# EAGLE design MODULO2_2 (EAGLE 7.1.0)
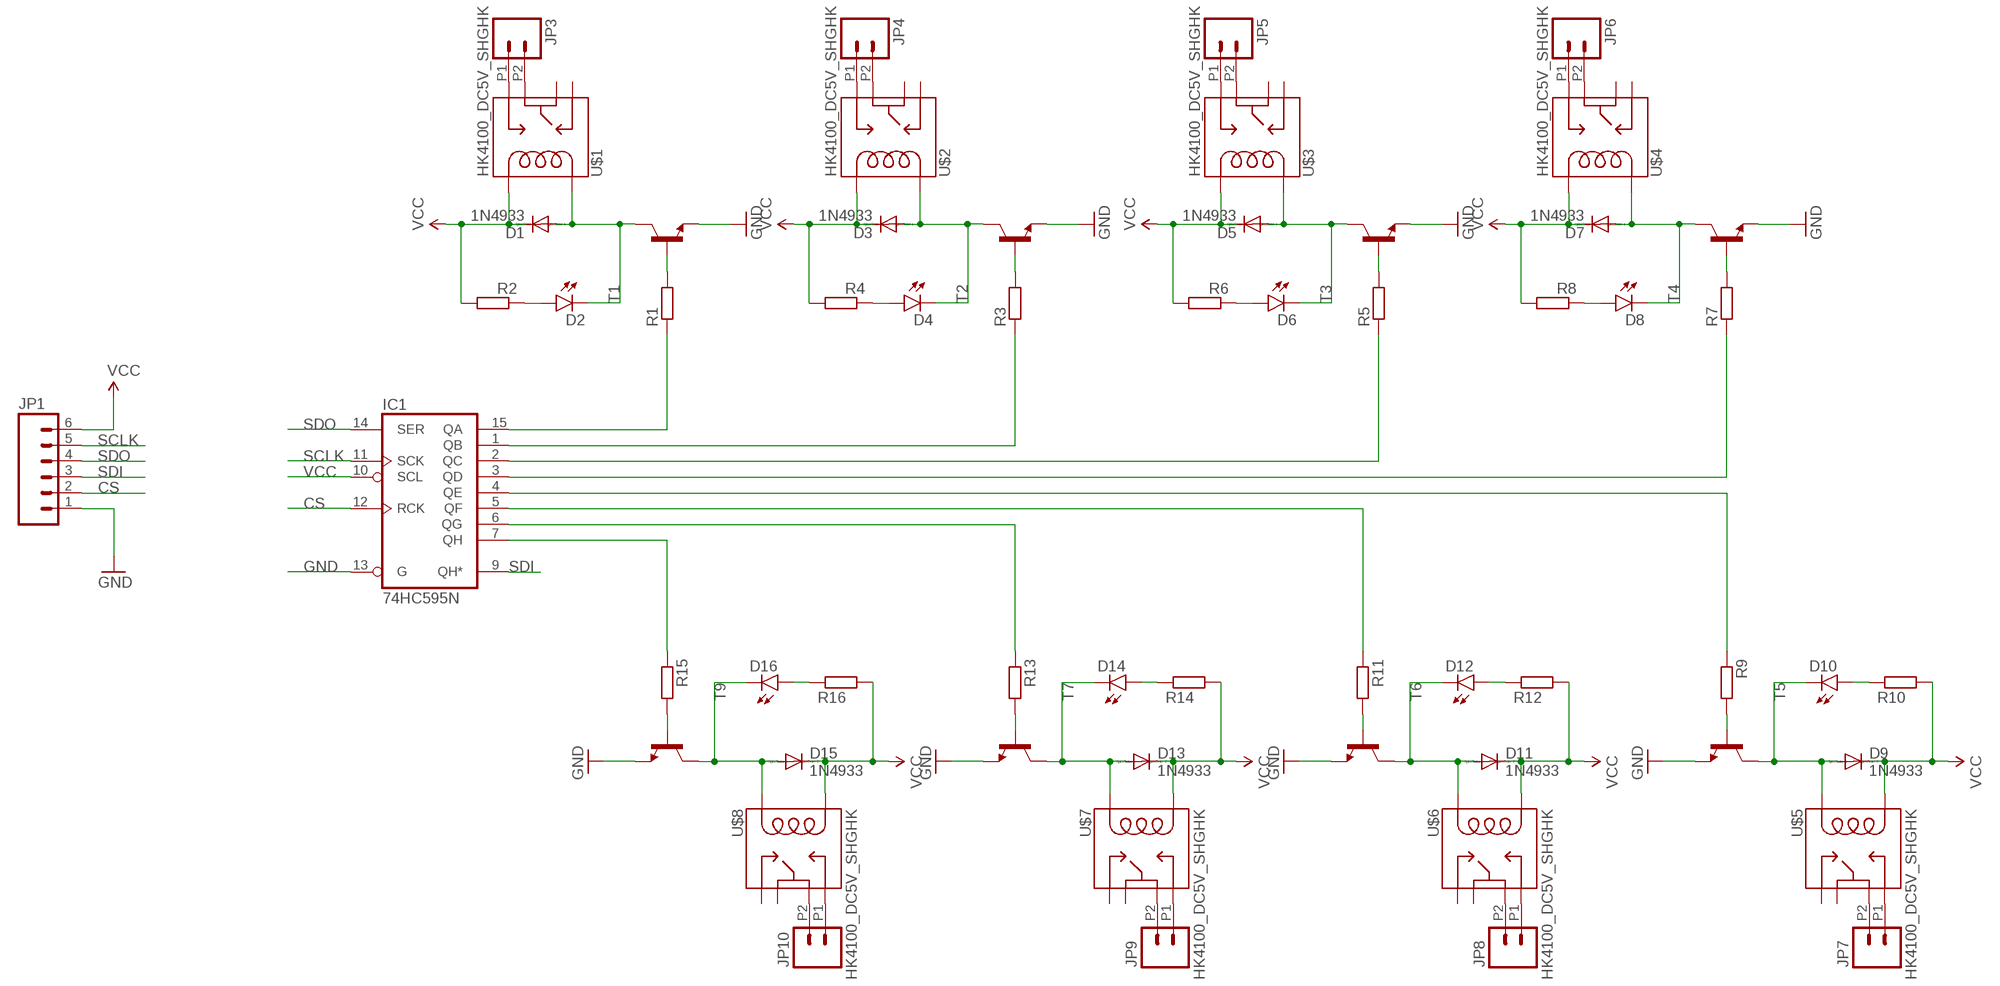
[diagram p0: schematic, sheet 1]

## Parts
D1  1N4933  [DO41-10]
D2  LED5MM  [LED5MM]
D3  1N4933  [DO41-10]
D4  LED5MM  [LED5MM]
D5  1N4933  [DO41-10]
D6  LED5MM  [LED5MM]
D7  1N4933  [DO41-10]
D8  LED5MM  [LED5MM]
D9  1N4933  [DO41-10]
D10  LED5MM  [LED5MM]
D11  1N4933  [DO41-10]
D12  LED5MM  [LED5MM]
D13  1N4933  [DO41-10]
D14  LED5MM  [LED5MM]
D15  1N4933  [DO41-10]
D16  LED5MM  [LED5MM]
IC1  74HC595N  [DIL16]
JP1  M06LOCK  [1X06_LOCK]
JP3  M022.54MM_SCREWTERM  [1X02_2.54_SCREWTERM]
JP4  M022.54MM_SCREWTERM  [1X02_2.54_SCREWTERM]
JP5  M022.54MM_SCREWTERM  [1X02_2.54_SCREWTERM]
JP6  M022.54MM_SCREWTERM  [1X02_2.54_SCREWTERM]
JP7  M022.54MM_SCREWTERM  [1X02_2.54_SCREWTERM]
JP8  M022.54MM_SCREWTERM  [1X02_2.54_SCREWTERM]
JP9  M022.54MM_SCREWTERM  [1X02_2.54_SCREWTERM]
JP10  M022.54MM_SCREWTERM  [1X02_2.54_SCREWTERM]
R1  R-EU_R0805  [R0805]
R2  R-EU_R0805  [R0805]
R3  R-EU_R0805  [R0805]
R4  R-EU_R0805  [R0805]
R5  R-EU_R0805  [R0805]
R6  R-EU_R0805  [R0805]
R7  R-EU_R0805  [R0805]
R8  R-EU_R0805  [R0805]
R9  R-EU_R0805  [R0805]
R10  R-EU_R0805  [R0805]
R11  R-EU_R0805  [R0805]
R12  R-EU_R0805  [R0805]
R13  R-EU_R0805  [R0805]
R14  R-EU_R0805  [R0805]
R15  R-EU_R0805  [R0805]
R16  R-EU_R0805  [R0805]
T1  -NPN-TO92-EBC  [TO92-EBC]
T2  -NPN-TO92-EBC  [TO92-EBC]
T3  -NPN-TO92-EBC  [TO92-EBC]
T4  -NPN-TO92-EBC  [TO92-EBC]
T5  -NPN-TO92-EBC  [TO92-EBC]
T6  -NPN-TO92-EBC  [TO92-EBC]
T7  -NPN-TO92-EBC  [TO92-EBC]
T9  -NPN-TO92-EBC  [TO92-EBC]
U$1  HK4100_DC5V_SHGHK  [HK4100]
U$2  HK4100_DC5V_SHGHK  [HK4100]
U$3  HK4100_DC5V_SHGHK  [HK4100]
U$4  HK4100_DC5V_SHGHK  [HK4100]
U$5  HK4100_DC5V_SHGHK  [HK4100]
U$6  HK4100_DC5V_SHGHK  [HK4100]
U$7  HK4100_DC5V_SHGHK  [HK4100]
U$8  HK4100_DC5V_SHGHK  [HK4100]

## Nets
CS: IC1.12(RCK) JP1.2
GND: IC1.13(G) JP1.1 T1.E T2.E T3.E T4.E T5.E T6.E T7.E T9.E
N$1: IC1.15(QA) R1.1
N$2: IC1.1(QB) R3.1
N$3: D1.A D2.K(C) T1.C U$1.6
N$4: D2.A R2.1
N$5: R1.2 T1.B
N$6: D3.A D4.K(C) T2.C U$2.6
N$7: D5.A D6.K(C) T3.C U$3.6
N$8: D6.A R6.1
N$9: R5.2 T3.B
N$10: D7.A D8.K(C) T4.C U$4.6
N$11: D8.A R8.1
N$12: R7.2 T4.B
N$13: IC1.3(QD) R7.1
N$14: D4.A R4.1
N$15: R3.2 T2.B
N$16: IC1.2(QC) R5.1
N$17: D9.A D10.K(C) T5.C U$5.6
N$18: D10.A R10.1
N$19: R9.2 T5.B
N$20: D11.A D12.K(C) T6.C U$6.6
N$21: D12.A R12.1
N$22: R11.2 T6.B
N$23: D13.A D14.K(C) T7.C U$7.6
N$24: D14.A R14.1
N$25: R13.2 T7.B
N$26: D15.A D16.K(C) T9.C U$8.6
N$27: D16.A R16.1
N$28: R15.2 T9.B
N$29: IC1.5(QF) R11.1
N$30: IC1.4(QE) R9.1
N$31: IC1.6(QG) R13.1
N$32: IC1.7(QH) R15.1
N$34: JP3.P1 U$1.8
N$35: JP3.P2 U$1.14
N$36: JP4.P1 U$2.8
N$37: JP4.P2 U$2.14
N$38: JP5.P1 U$3.8
N$39: JP5.P2 U$3.14
N$40: JP6.P1 U$4.8
N$41: JP6.P2 U$4.14
N$42: JP7.P1 U$5.8
N$43: JP7.P2 U$5.14
N$44: JP8.P1 U$6.8
N$45: JP8.P2 U$6.14
N$46: JP9.P1 U$7.8
N$47: JP9.P2 U$7.14
N$48: JP10.P1 U$8.8
N$49: JP10.P2 U$8.14
SCLK: IC1.11(SCK) JP1.5
SDI: IC1.9(QH*) JP1.3
SDO: IC1.14(SER) JP1.4
VCC: D1.C D3.C D5.C D7.C D9.C D11.C D13.C D15.C IC1.10(SCL) JP1.6 R2.2 R4.2 R6.2 R8.2 R10.2 R12.2 R14.2 R16.2 U$1.9 U$2.9 U$3.9 U$4.9 U$5.9 U$6.9 U$7.9 U$8.9
Unconnected: U$1.1 U$1.7 U$2.1 U$2.7 U$3.1 U$3.7 U$4.1 U$4.7 U$5.1 U$5.7 U$6.1 U$6.7 U$7.1 U$7.7 U$8.1 U$8.7

## Power pins joined to a net without a drawn wire
GND: IC1.8(GND)
VCC: IC1.16(VCC)

## Library data of the parts
D1 D3 D5 D7 D9 D11 D13 D15 = diode:1N4933: DIODE fast recovery rectifier, 1A
D2 D4 D6 D8 D10 D12 D14 D16 = SparkFun-LED:LED: LEDs Standard schematic elements and footprints for 5mm, 3mm, 1206, and 0603 sized LEDs. 5mm - Spark Fun Electronics SKU : COM-00529 (and others)
IC1 = 74xx-eu:74*595: 8-bit SHIFT REGISTER, output latch
JP1 = SparkFun-Connectors:M06: Header 6 Standard 6-pin 0.1" header. Use with straight break away headers (SKU : PRT-00116), right angle break away headers (PRT-00553), swiss pins (PRT-00743), machine pins (PRT-00117), and female headers (PRT-00115). Molex polarized connector foot print use with SKU : PRT-08094 with associated crimp pins and housings. NOTES ON THE VARIANTS LOCK and LOCK_LONGPADS... This footprint was designed to help hold the alignment of a through-hole component (i.e. 6-pin header) while soldering it into place. You may notice that each hole has been shifted either up or down by 0.005 of an inch from it's more standard position (which is a perfectly straight line). This slight alteration caused the pins (the squares in the middle) to touch the edges of the holes. Because they are alternating, it causes a "brace" to hold the component in place. 0.005 has proven to be the perfect amount of "off-center" position when using our standard breakaway headers. Although looks a little odd when you look at the bare footprint, once you have a header in there, the alteration is very hard to notice. Also,if you push a header all the way into place, it is covered up entirely on the bottom side. This idea of altering the position of holes to aid alignment will be further integrated into the Sparkfun Library for other footprints. It can help hold any component with 3 or more connection pins.
JP3-JP10 = SparkFun-Connectors:M02: Standard 2-pin 0.1" header. Use with - straight break away headers ( PRT-00116) - right angle break away headers (PRT-00553) - swiss pins (PRT-00743) - machine pins (PRT-00117) - female headers (PRT-00115) Molex polarized connector foot print use with: PRT-08233 with associated crimp pins and housings. 2.54_SCREWTERM for use with PRT-10571. 3.5mm Screw Terminal footprints for PRT-08084 5mm Screw Terminal footprints for use with PRT-08432
R1-R16 = resistor:R-EU_: RESISTOR, European symbol
T1-T7 T9 = transistor:*-NPN-: NPN Transistror BF959 corrected 2008.03.06
U$1-U$8 = SparkFun-Electromechanical:HK4100_DC5V_SHG

## Board
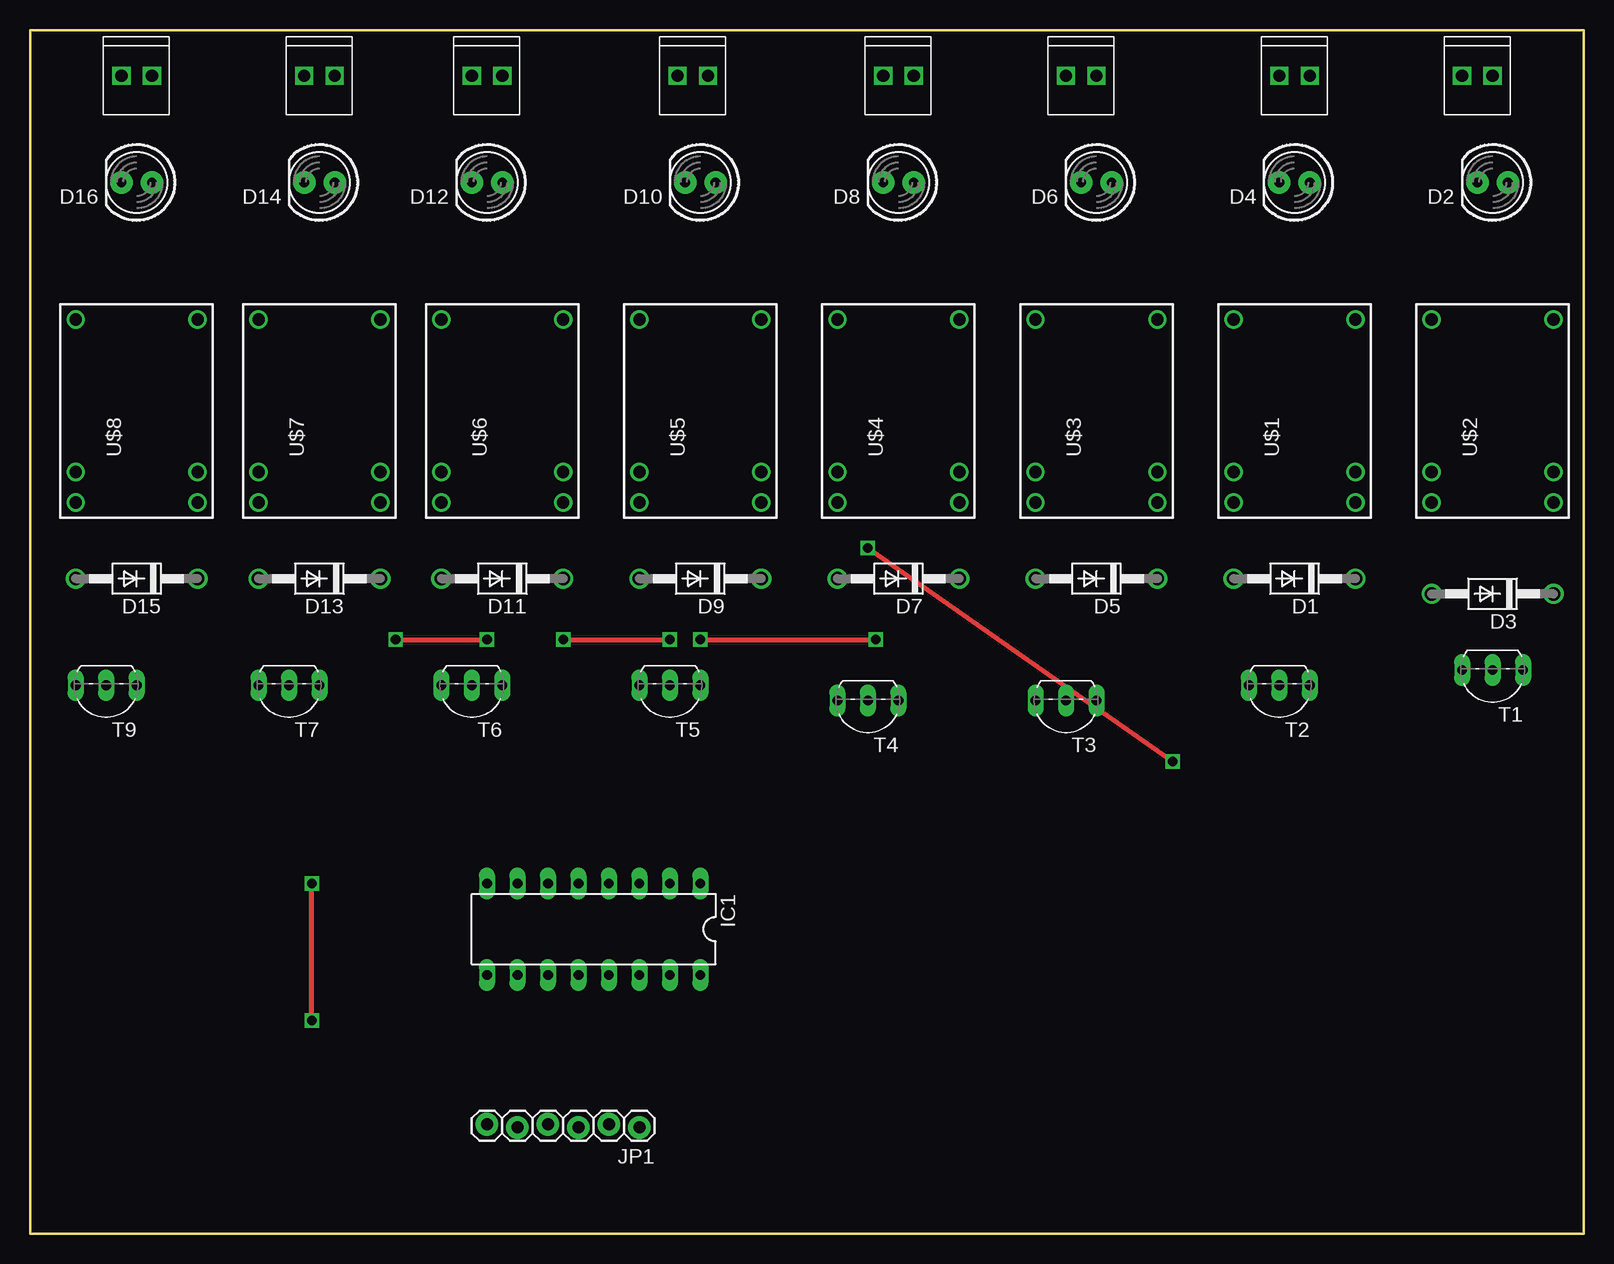
[diagram p1: board, top side]
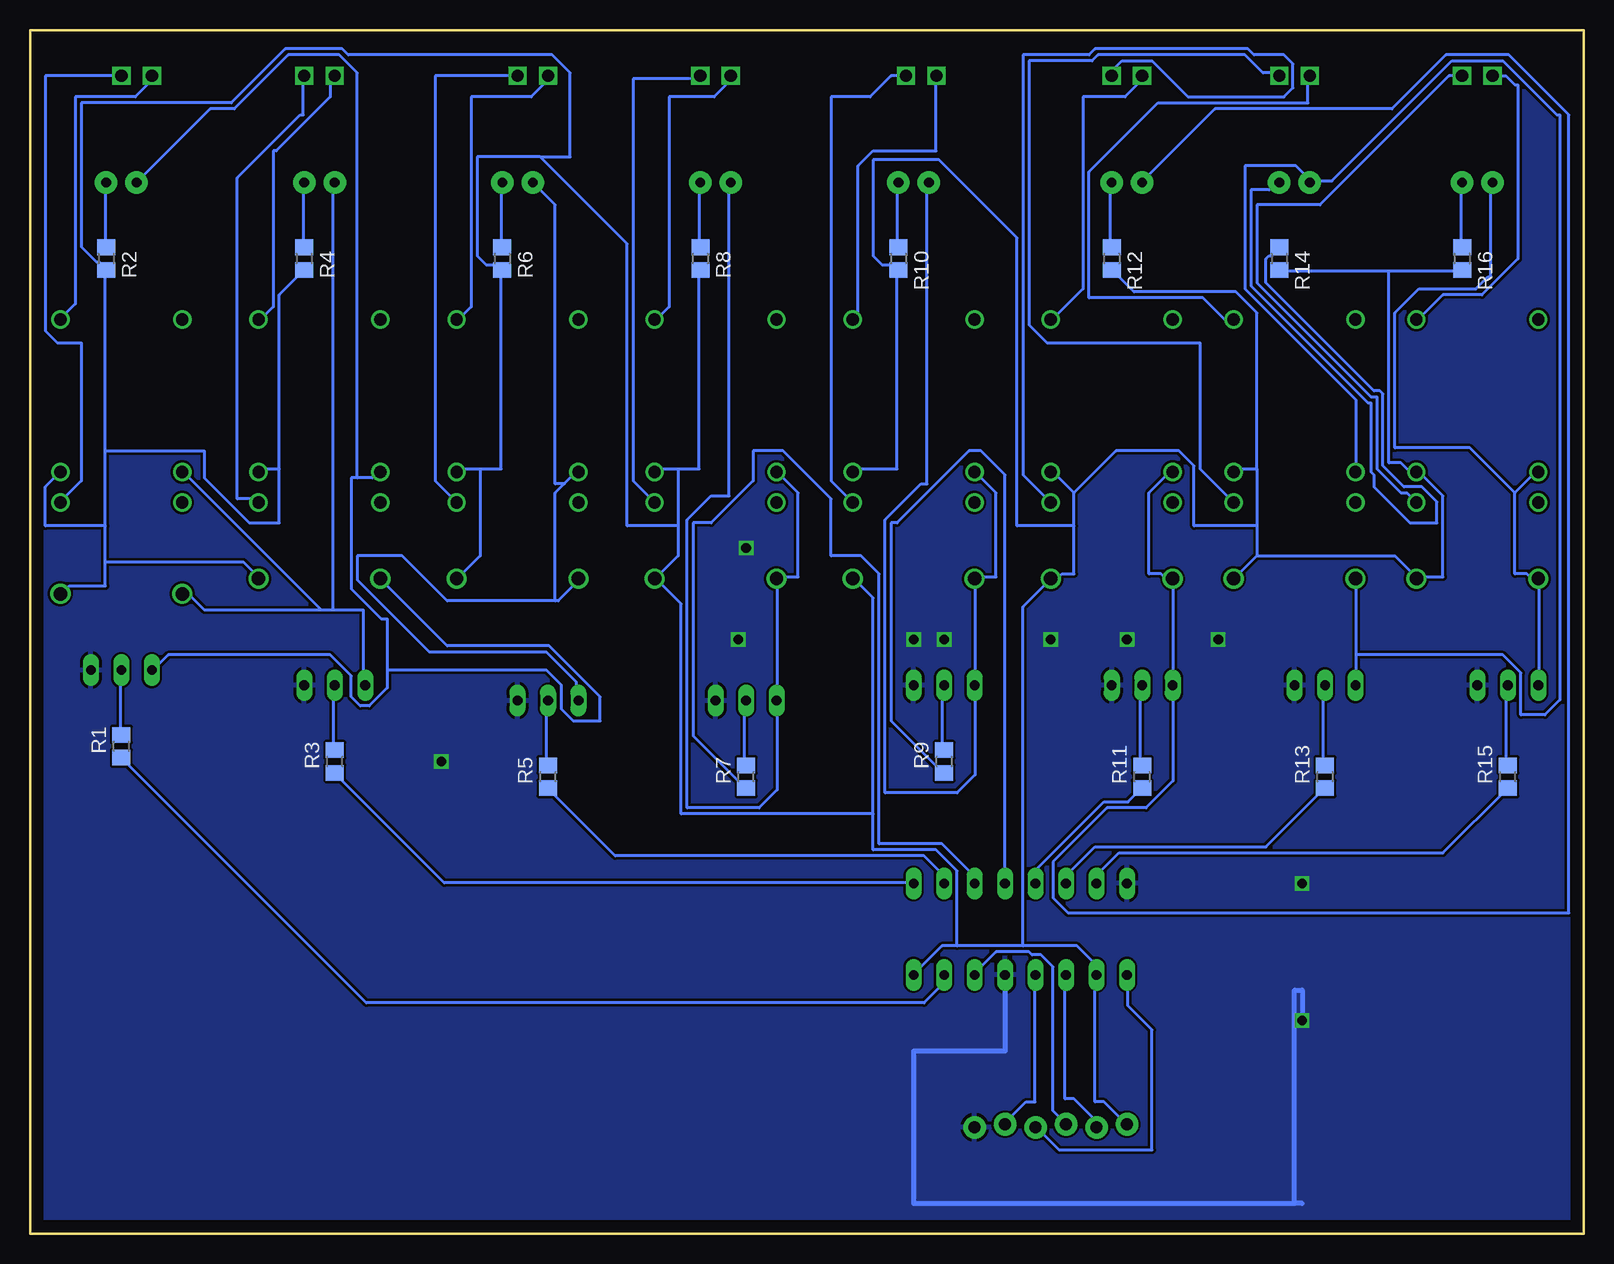
[diagram p2: board, bottom side, seen from below]

Size 129.54 x 100.33 mm. Coordinates in mm from the lower left corner, seen from the top.
Outline: 0,0 129.54,0 129.54,100.33 0,100.33 0,0
Copper layers (1*16): Top 0.035mm / dielectric 1.5mm / Bottom 0.035mm
Design rules "default": minimum track width 10mil, minimum drill 24mil, track to track 8mil, track to pad 8mil, pad to pad 8mil, via to via 8mil, smd to smd 8mil, copper to edge 40mil, drill to drill 8mil, minimum pad ring 10mil, minimum via ring 8mil, stop-mask expansion 4mil, vias tented up to drill 0mil, thermal gap 10mil

### Footprints (pad centres in the part's own frame; a part is rotated, then mirrored left to right if it is on the bottom)
DO41-10 = drill 1.118: A 5.08,0; C -5.08,0
LED5MM = drill 0.813 pad 1.88: A -1.27,0; K 1.27,0
DIL16 = drill 0.813 long: 1 -8.89,-3.81; 2 -6.35,-3.81; 3 -3.81,-3.81; 4 -1.27,-3.81; 5 1.27,-3.81; 6 3.81,-3.81; 7 6.35,-3.81; 8 8.89,-3.81; 9 8.89,3.81; 10 6.35,3.81; 11 3.81,3.81; 12 1.27,3.81; 13 -1.27,3.81; 14 -3.81,3.81; 15 -6.35,3.81; 16 -8.89,3.81
1X06_LOCK = drill 1.016 pad 1.88: 1 0,0; 2 2.54,-0.254; 3 5.08,0; 4 7.62,-0.254; 5 10.16,0; 6 12.7,-0.254
1X02_2.54_SCREWTERM = drill 1.016 square: P1 2.54,0; P2 0,0
R0805 = smd 1.3 x 1.5: 1 -0.95,0; 2 0.95,0
TO92-EBC = drill 0.813 long: B 0,-1.27; C 2.54,-1.27; E -2.54,-1.27
HK4100 = drill 1.016: 1 7.62,5.08; 6 -5.08,5.08; 7 -7.62,5.08; 8 -7.62,-5.08; 9 -5.08,-5.08; 14 7.62,-5.08

### Placement (x,y rotation side)
D1  105.41,54.61 180 top
D2  121.92,87.63 180 top
D3  121.92,53.34 180 top
D4  105.41,87.63 180 top
D5  88.9,54.61 180 top
D6  88.9,87.63 180 top
D7  72.39,54.61 180 top
D8  72.39,87.63 180 top
D9  55.88,54.61 180 top
D10  55.88,87.63 180 top
D11  39.37,54.61 180 top
D12  38.1,87.63 180 top
D13  24.13,54.61 180 top
D14  24.13,87.63 180 top
D15  8.89,54.61 180 top
D16  8.89,87.63 180 top
IC1  46.99,25.4 180 top
JP1  50.8,8.89 180 top
JP3  104.14,96.52 0 top
JP4  119.38,96.52 0 top
JP5  86.36,96.52 0 top
JP6  71.12,96.52 0 top
JP7  53.98,96.52 0 top
JP8  36.83,96.52 0 top
JP9  22.86,96.52 0 top
JP10  7.62,96.52 0 top
R1  121.92,40.64 90 bottom
R2  123.19,81.28 270 bottom
R3  104.14,39.37 90 bottom
R4  106.68,81.28 270 bottom
R5  86.36,38.1 90 bottom
R6  90.17,81.28 270 bottom
R7  69.85,38.1 90 bottom
R8  73.66,81.28 270 bottom
R9  53.34,39.37 90 bottom
R10  57.15,81.28 270 bottom
R11  36.83,38.1 90 bottom
R12  39.37,81.28 270 bottom
R13  21.59,38.1 90 bottom
R14  25.4,81.28 270 bottom
R15  6.35,38.1 90 bottom
R16  10.16,81.28 270 bottom
T1  121.92,45.72 180 top
T2  104.14,44.45 180 top
T3  86.36,43.18 180 top
T4  69.85,43.18 180 top
T5  53.34,44.45 180 top
T6  36.83,44.45 180 top
T7  21.59,44.45 180 top
T9  6.35,44.45 180 top
U$1  105.41,68.58 90 top
U$2  121.92,68.58 90 top
U$3  88.9,68.58 90 top
U$4  72.39,68.58 90 top
U$5  55.88,68.58 90 top
U$6  39.37,68.58 90 top
U$7  24.13,68.58 90 top
U$8  8.89,68.58 90 top

### Tracks (layer width: path | path; a pad name or v marks a point on that pad's centre or on a via)
CS
  Bottom 0.254: IC1.12 45.75,21.5 45.75,11 46.5,11 48.25,9.25 JP1.2
GND  (via drill 0.8)
  Top 0.406: v23.5,17.78 v23.5,29.21 | v30.48,49.53 v38.1,49.53 | v44.45,49.53 v53.34,49.53 | v55.88,49.53 v70.48,49.53 | v95.25,39.37 v69.85,57.15
  Bottom 0.406: IC1.13 48.26,15.24 55.88,15.24 55.88,2.54 24.13,2.54 | 23.5,2.54 24.13,2.54 | 24.13,2.54 24.13,20.32 23.5,20.32 v23.5,17.78
  pour Bottom: 0,0 0,100.33 129.54,100.33 129.54,0
N$1
  Bottom 0.254: R1.1 121.75,39.5 101.5,19.25 55,19.25 53.5,20.75 53.5,21.5 IC1.15
N$2
  Bottom 0.254: R3.1 104,38.25 95,29.25 56,29.25 IC1.1
N$3
  Bottom 0.254: 99.75,47 99.75,51.25 100.25,51.25 102.75,53.75 102.75,63 102.25,63 | 99.75,47 99.75,45.5 101.25,44 102,44 102.75,44.75 102.75,46.5 104.5,48.25 118,48.25 119.25,47 T1.C | 102.25,63 101,63 100.5,63.5 U$1.6 | 99.75,47 86.5,47 85.25,45.75 85.25,43.75 84.25,42.75 82,42.75 82,44.75 86.25,49 94.75,49 100.25,54.5 D1.A | 102.25,63 102.25,96.75 103.75,98.25 108,98.25 112.5,93.75 114.5,93.75 120.5,87.75 D2.K
N$4
  Bottom 0.254: R2.1 123.25,82.25 123.25,87.5 D2.A
N$5
  Bottom 0.254: R1.2 122,41.75 122,46.75 T1.B
N$6
  Bottom 0.254: 105.25,52 115,52 116.25,53.25 116.75,53.25 D3.A | 105.25,52 104.25,52 | 104.25,52 101.75,52 101.75,45.75 T2.C | 105.25,52 116.75,63.5 U$2.6 | 104.25,52 104.25,87.5 D4.K
N$7
  Bottom 0.254: 85.75,52.75 85.5,52.75 83.75,54.5 D5.A | 85.75,52.75 94.75,52.75 98.5,56.5 102.25,56.5 102.25,54.5 96.25,48.5 86.5,48.5 84,46 84,44.5 T3.C | 85,62.5 85.75,61.75 85.75,52.75 | 85,62.5 84,63.5 U$3.6 | D6.K 85.75,85.75 85.75,62.5 85,62.5
N$8
  Bottom 0.254: R6.1 90.25,82.25 90.25,87.5 D6.A
N$9
  Bottom 0.254: R5.2 86.5,39.25 86.5,44.25 T3.B
N$10
  Bottom 0.254: U$4.6 67.25,63.5 65.5,61.75 65.5,54.75 67.25,54.75 D7.A 67.25,54.5 67.25,44.5 T4.C 67.25,44.25 67.25,37 68.75,35.5 74.75,35.5 74.75,59.5 72.75,61.5 71.25,61.5 71.25,87.5 D8.K
N$11
  Bottom 0.254: R8.1 73.75,82.25 73.75,87.5 D8.A
N$12
  Bottom 0.254: R7.2 70,39.25 70,44.25 T4.B
N$13
  Bottom 0.254: R7.1 70,37.25 74.25,41.5 74.25,59.25 72.75,59.25 69.25,62.75 69.25,65.25 66.75,65.25 62.75,61.25 62.75,56.5 60.25,56.5 58.75,55 58.75,32.5 53.5,32.5 51,30 51,29.25 IC1.3
N$14
  Bottom 0.254: R4.1 106.75,82.25 106.75,87.5 D4.A
N$15
  Bottom 0.254: R3.2 104.25,40.5 104.25,45.5 T2.B
N$16
  Bottom 0.254: R5.1 86.25,37 80.75,31.5 55,31.5 53.5,30 53.5,29.25 IC1.2
N$17
  Bottom 0.254: U$5.6 50.75,63.5 49,61.75 49,54.75 50.75,54.75 D9.A 50.75,54.5 50.75,45.75 T5.C 50.75,45.5 50.75,38.25 52.25,36.75 58.25,36.75 58.25,59.5 55.25,62.5 54.75,62.5 54.75,87.5 D10.K
N$18
  Bottom 0.254: R10.1 57.25,82.25 57.25,87.5 D10.A
N$19
  Bottom 0.254: R9.2 53.5,40.5 53.5,45.5 T5.B
N$20
  Bottom 0.254: U$6.6 34.5,63.5 36.25,61.75 36.25,55 35.25,55 35,54.75 34.5,54.75 D11.A 34.25,54.5 34.25,45.75 T6.C 34.25,45.5 34.25,37.75 36.5,35.5 39.75,35.5 44.25,31 44.25,28 43,26.75 1.25,26.75 1.25,93.25 6.25,98.25 11.5,98.25 16,93.75 30.75,93.75 36.75,87.75 D12.K
N$21
  Bottom 0.254: R12.1 39.5,82.25 39.5,87.5 D12.A
N$22
  Bottom 0.254: R11.2 37,39.25 37,45.5 T6.B
N$23
  Bottom 0.254: 19,48.25 19,54.5 D13.A | 19,48.25 19,45.75 T7.C | 22.75,87.75 24,89 28.25,89 28.25,78.75 19,69.5 19,63.5 U$7.6 | 19,48.25 6.75,48.25 5.25,46.75 5.25,43.25 3.25,43.25 2,44.5 2,93.25 2.25,93.25 6.75,97.75 11,97.75 21,87.75 22.75,87.75 | 22.75,87.75 D14.K
N$24
  Bottom 0.254: R14.1 25.5,82 26,81.5 26.25,81.5 26.5,81.25 26.5,79.25 17.5,70.25 17,70.25 16.75,70 16.75,64 15,62.25 13.5,62.25 12.25,61 12.25,59.25 14.5,59.25 17.5,62.25 17.5,63.25 17.75,63.5 17.75,69.25 18,69.25 27.75,79 27.75,87 26.25,87 25.75,87.5 25.5,87.5 D14.A
N$25
  Bottom 0.254: R13.2 21.75,39.25 21.75,45.5 T7.B
N$26
  Bottom 0.254: T9.C 3.75,45.75 3.75,54.5 D15.A 4,54.75 4.5,54.75 4.75,55 5.75,55 5.75,61.75 | 5.75,61.75 4,63.5 U$8.6 | 5.75,61.75 9.5,65.5 15.75,65.5 15.75,76.75 13.75,78.75 9,78.75 8,79.75 7.75,79.75 7.75,87.5 D16.K
N$27
  Bottom 0.254: R16.1 10.25,82.25 10.25,87.5 D16.A
N$28
  Bottom 0.254: R15.2 6.5,39.25 6.5,45.5 T9.B
N$29
  Bottom 0.254: R11.1 37,37 38,36 40,36 45.5,30.5 45.5,29.25 IC1.5
N$30
  Bottom 0.254: R9.1 53.5,38.5 57.75,42.75 57.75,59.25 57.25,59.25 51.25,65.25 50.25,65.25 48.25,63.25 48.25,29.25 IC1.4
N$31
  Bottom 0.254: R13.1 21.75,37 26.5,32.25 40.75,32.25 43,30 43,29.25 IC1.6
N$32
  Bottom 0.254: R15.1 11.75,31.75 38.75,31.75 40.5,30 40.5,29.25 IC1.7
N$34
  Bottom 0.254: JP3.P1 106.75,96.5 106.75,93.25 107,93.25 112.25,88 112.25,61.25 110.75,61.25 110.5,61 U$1.8
N$35
  Bottom 0.254: U$1.14 110.25,76.25 109.25,77.25 109.25,90.25 109,90.25 104.5,94.75 104.5,96.5 104.25,96.5 JP3.P2
N$36
  Bottom 0.254: U$2.8 127,61 125.25,62.75 125.25,74.25 127.25,74.25 128.25,75.25 128.25,96.5 122,96.5 JP4.P1
N$37
  Bottom 0.254: U$2.14 127,76.25 125.75,77.5 125.75,94.75 120.75,94.75 119.5,96 119.5,96.5 JP4.P2
N$38
  Bottom 0.254: U$3.8 94,61 95.75,62.75 95.75,96.5 89,96.5 JP5.P1
N$39
  Bottom 0.254: U$3.14 93.75,76.25 92.75,77.25 92.75,94.75 87.75,94.75 86.5,96 86.5,96.5 JP5.P2
N$40
  Bottom 0.254: U$4.8 77.5,61 79.25,62.75 79.25,96.25 74,96.25 73.75,96.5 JP6.P1
N$41
  Bottom 0.254: U$4.14 77.25,76.25 76.25,77.25 76.25,94.75 72.5,94.75 71.25,96 71.25,96.5 JP6.P2
N$42
  Bottom 0.254: U$5.8 62.75,62.75 62.75,94.75 59.5,94.75 57.75,96.5 56.75,96.5 JP7.P1
N$43
  Bottom 0.254: JP7.P2 54,96.5 54,90.25 59.25,90.25 60.5,89 60.5,76.25 60.75,76.25 U$5.14
N$44
  Bottom 0.254: U$6.8 44.5,61 46.75,63.25 46.75,98.25 41.25,98.25 40.75,98.75 28,98.75 27.5,98.25 25,98.25 24.25,97.5 24.25,95.5 25,94.75 33,94.75 36,97.75 38.5,97.75 39.5,96.75 JP8.P1
N$45
  Bottom 0.254: U$6.14 44.25,76.25 41.75,78.75 41.75,94.75 38.25,94.75 37,96 37,96.5 JP8.P2
N$46
  Bottom 0.254: U$7.8 32,63.75 32,74.25 44.75,74.25 46.25,75.75 46.25,97.75 41,97.75 40.5,98.25 28.25,98.25 26.75,96.75 25.5,96.75 JP9.P1
N$47
  Bottom 0.254: JP9.P2 23,96.5 23,94.25 35.5,94.25 41.25,88.5 41.25,78 31.75,78 29.75,76 29.25,76 U$7.14
N$48
  Bottom 0.254: U$8.8 14,61 14.75,61.75 15.25,61.75 17.25,63.75 17.25,69.75 17.75,69.75 27.25,79.25 27.25,85.75 22,85.75 11.25,96.5 10.25,96.5 JP10.P1
N$49
  Bottom 0.254: U$8.14 13.75,76.25 11.75,78.25 8.5,78.25 5.5,81.25 5.5,95.75 5.75,95.75 6.5,96.5 7.5,96.5 JP10.P2
SCLK
  Bottom 0.254: IC1.11 43.25,21.5 43.25,11.25 42.5,11.25 40.75,9.5 40.75,9 JP1.5
SDI
  Bottom 0.254: IC1.9 38,21.5 38,19 36,17 36,7 43.75,7 45.5,8.75 JP1.3
SDO
  Bottom 0.254: IC1.14 50.75,21.75 49,23.5 46.25,23.5 46,23.25 45.25,23.25 44.25,22.25 44.25,10.25 43.25,9.25 JP1.4
VCC
  Bottom 0.254: U$5.9 60.75,63.5 60.5,63.75 57.25,63.75 57.25,80.25 R10.2 57.25,80.5 57.5,80.75 58.5,80.75 59.25,81.5 59.25,89.5 53.75,89.5 47.25,83 47.25,59 42.5,59 | 16.25,80.25 25.25,80.25 R14.2 | 16.25,80.25 10.25,80.25 R16.2 | 42.5,61.75 44.25,63.5 U$6.9 | 42.5,59 42.5,55 43.5,55 43.75,54.75 44.25,54.75 D11.C 44.5,54.5 46.75,52.25 46.75,24 | 42.5,59 42.5,61.75 | 27.25,63.75 27.25,76.75 29,78.5 37.5,78.5 39.25,80.25 R12.2 | 27.25,63.75 28.75,63.75 29,63.5 U$7.9 | 27.25,56.5 29,54.75 D13.C | 27.25,63.75 27.25,59 | 27.25,59 27.25,56.5 | 27.25,56.5 15.75,56.5 14,54.75 D15.C 13.75,54.75 11.75,54.75 11.75,61.5 13.75,63.5 U$8.9 14.5,63.5 15.25,64.25 16.25,64.25 16.25,80.25 | 42.5,61.75 39,65.25 33.75,65.25 32.5,64 32.5,59 27.25,59 | 108.75,63.75 108.75,78.25 106.75,80.25 R4.2 | 108.75,63.75 110,63.75 110.25,63.5 U$1.9 | 123.25,56 123.25,54 126.25,54 126.75,53.5 127,53.5 D3.C | 123.25,56 123.25,59 | 123.25,59 123.25,65.25 | 123.25,65.25 123.25,80.25 R2.2 123.25,80.5 123.75,81 124,81 125.25,82.25 125.25,94.25 112.75,94.25 108.25,98.75 103.5,98.75 103,98.25 86,98.25 84.5,96.75 84.5,89.75 87,89.75 | U$2.9 128.25,62.25 128.25,59 123.25,59 | 123.25,56 111.75,56 110.5,54.75 D1.C | 108.75,63.75 108.75,59.25 111.25,59.25 115,63 115,65.25 123.25,65.25 | 92,63.75 93.5,63.75 93.75,63.5 U$3.9 | 92,63.75 90.25,63.75 90.25,80.25 R6.2 90.25,80.5 90.5,80.75 91.5,80.75 92.25,81.5 92.25,89.75 87,89.75 | 92,63.75 92,56.5 93.75,54.75 D5.C | 75.5,63.75 77,63.75 77.25,63.5 U$4.9 | 75.5,63.75 73.75,63.75 73.75,80.25 R8.2 | 75.5,63.75 75.5,59 | 75.5,59 75.5,56.5 77.25,54.75 D7.C 77.25,54.5 75.25,52.5 75.25,35 59.25,35
  Bottom 0.254: JP1.6 38.25,9.25 40,11 40.75,11 40.75,21.5 IC1.10 40.75,21.75 40.75,22.5 42.25,24 46.75,24 | 46.75,24 52.25,24 | 52.25,24 53.5,24 55.75,21.75 IC1.16 | 59.25,35 59.25,32 54,32 52.25,30.25 52.25,24 | 59.25,35 59.25,53 60.75,54.5 D9.C | 87,89.75 79.75,82.5 79.75,59 75.5,59